# EAGLE design brick_analog_button_smd (EAGLE 7.3.0)
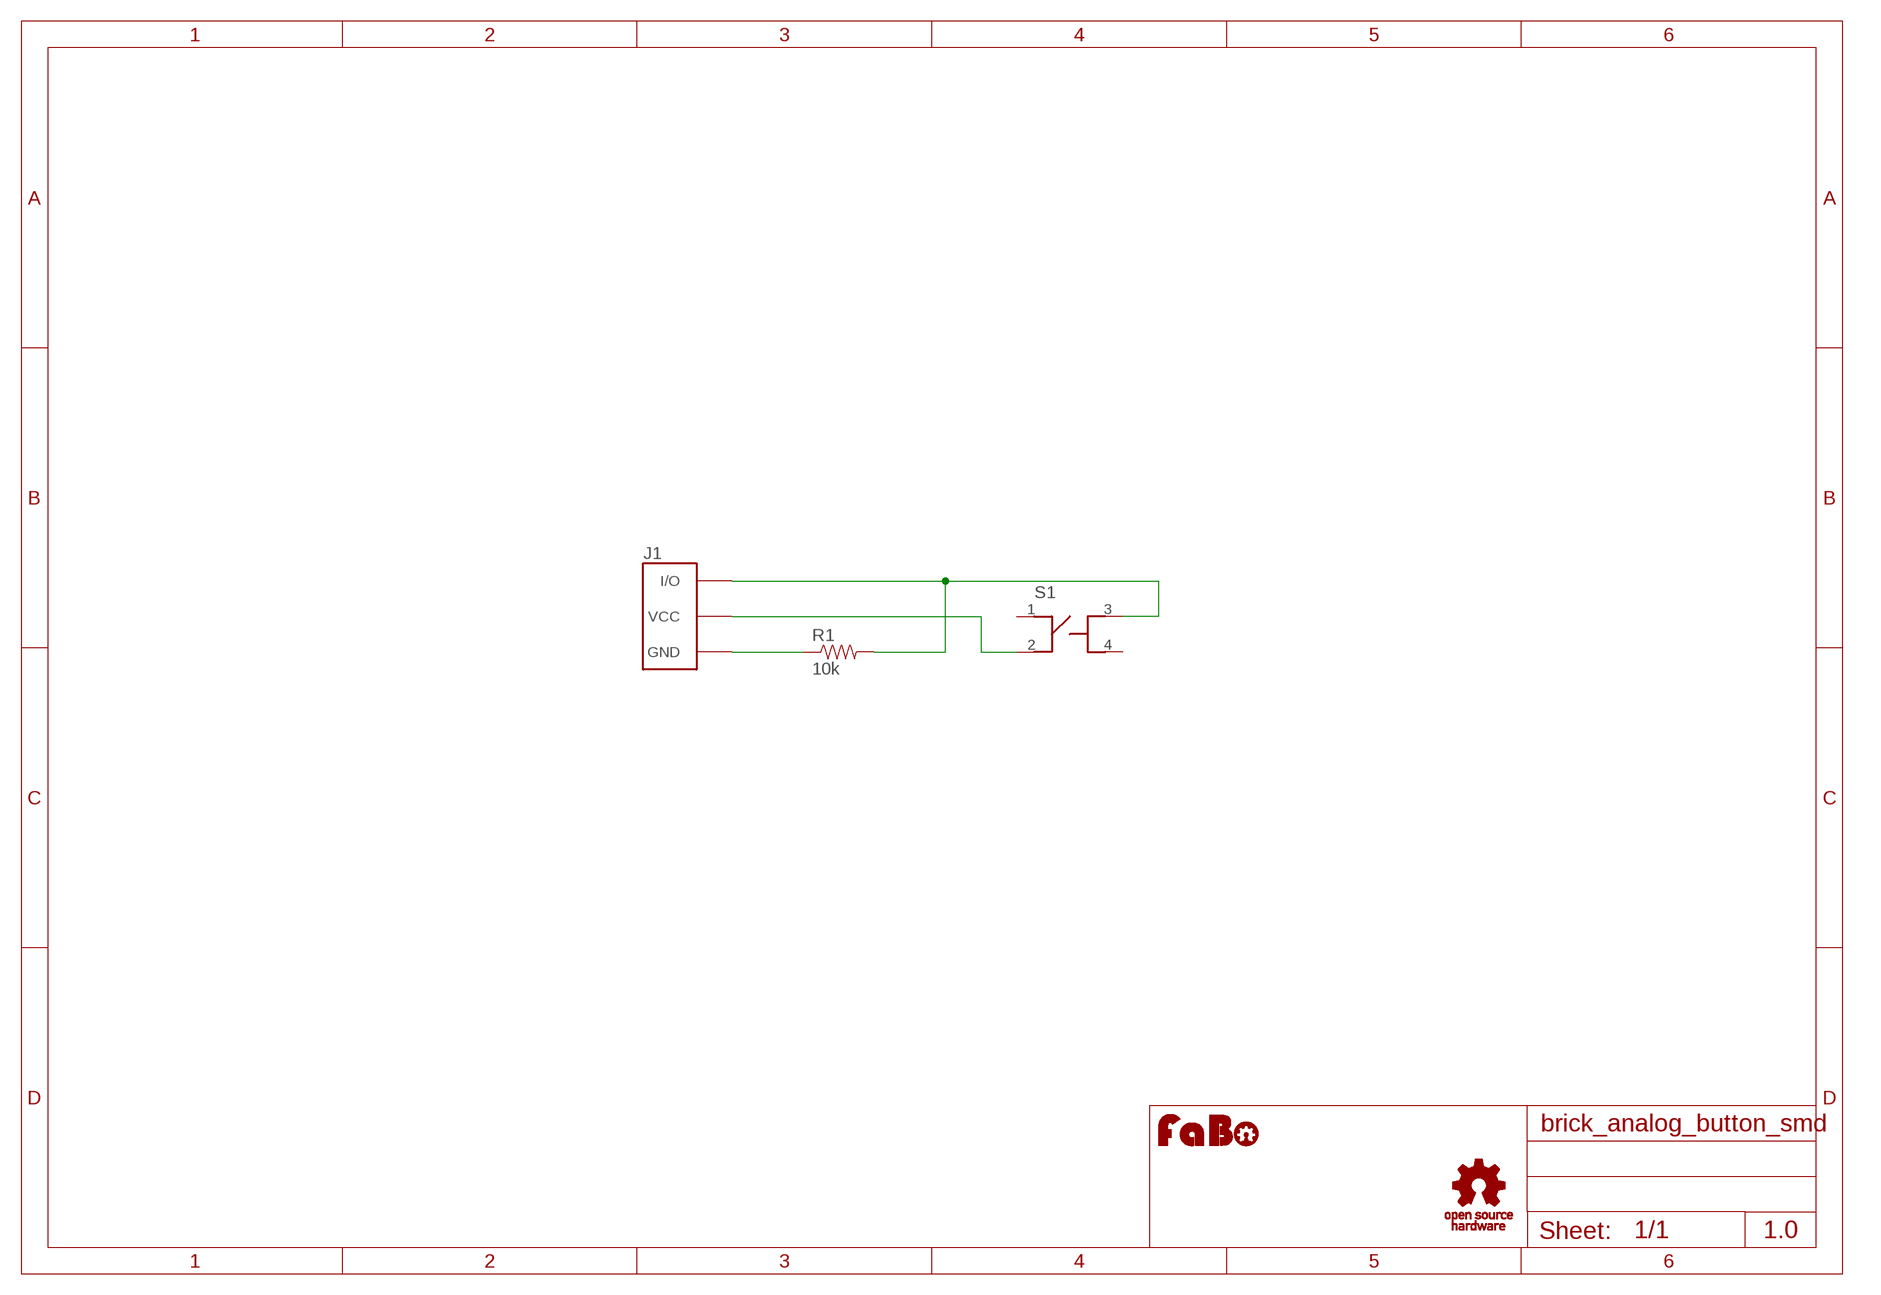
[diagram p0: schematic, sheet 1]

## Parts
J1  BRICK_3PIN_NORMAL  [BRICK_3PIN]
R1  10k  RESISTOR0603  [0603-RES]
S1  SWITCH-LS6J2M-T  [SWITCH-LS6J2M-T]
U$1  LOGO_FABO-M  [LOGO_FABO_M]
U$4  LOGO_OSHW_T-M  [LOGO_OSHW_T_M]

## Nets
GND: J1.GND R1.1
N$1: J1.VCC S1.2
N$3: J1.IN/OUT(I/O) R1.2 S1.3
Unconnected: S1.1 S1.4

## Notes on the sheet
- 1.0

## Library data of the parts
J1 = gclue:BRICK_3PIN: FaBo Brick 3pin
R1 = SparkFun-Resistors:RESISTOR: Resistor Basic schematic elements and footprints for 0603, 1206, and PTH resistors.
S1 = gclue:SWITCH-LS6J2M-T: Switch Tact SMD(LS6J2M-T)
U$1 = FaBo:LOGO_FABO
U$4 = gclue:LOGO_OSHW_T

## Board
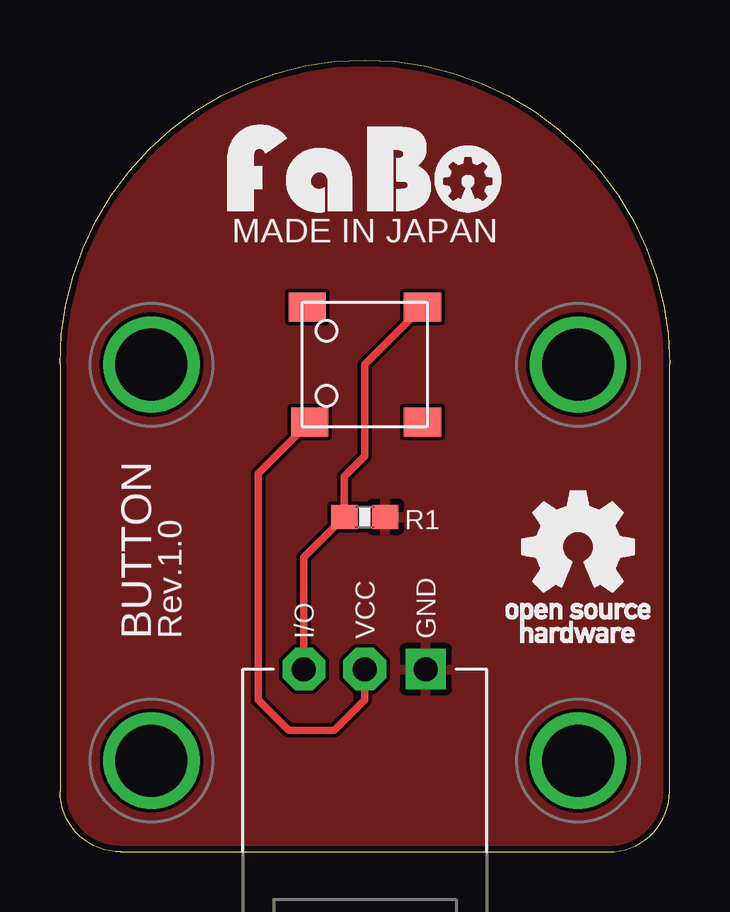
[diagram p1: board, top side]
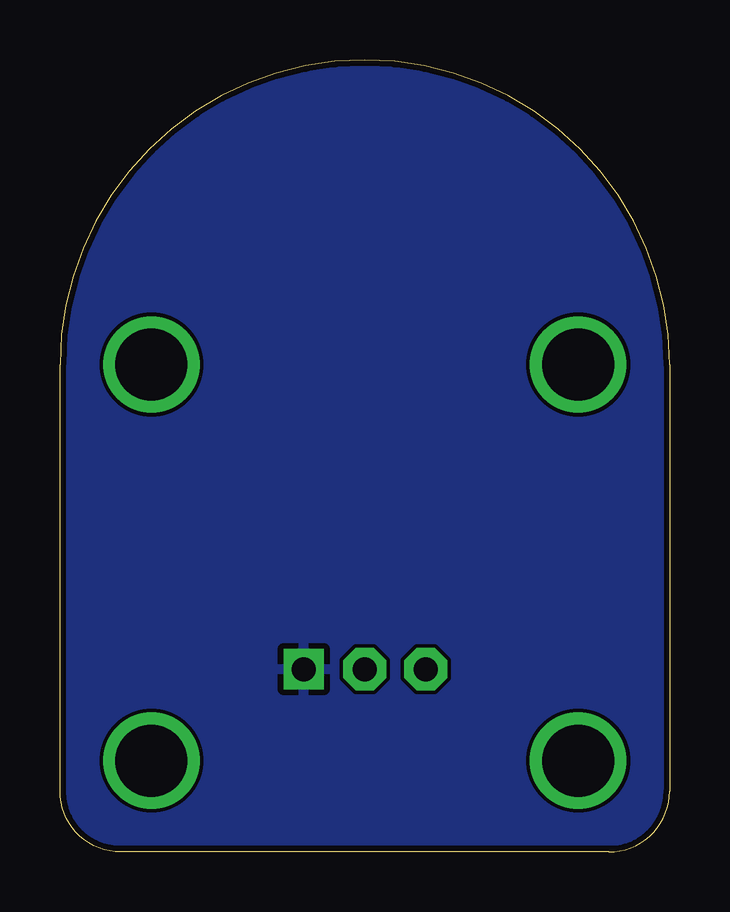
[diagram p2: board, bottom side, seen from below]

Size 25.4 x 33.02 mm. Coordinates in mm from the lower left corner, seen from the top.
Copper layers (1*16): Top 0.035mm / dielectric 1.5mm / Bottom 0.035mm
Design rules "Elecrow_2-layer_eagle_rule": minimum track width 6mil, minimum drill 12mil, track to track 6mil, track to pad 6mil, pad to pad 6mil, via to via 6mil, smd to smd 0mil, copper to edge 10mil, drill to drill 10mil, minimum pad ring 10mil, minimum via ring 6mil, stop-mask expansion 2mil, vias tented up to drill 100mil, thermal gap 10mil

### Footprints (pad centres in the part's own frame; a part is rotated, then mirrored left to right if it is on the bottom)
BRICK_3PIN = drill 1 pad 1.676 square: GND 2.54,-8.89 | drill 1 pad 1.778 octagon: IN/OUT -2.54,-8.89; VCC 0,-8.89 | drill 3 pad 3.81: P$5 -8.89,3.81; P$6 8.89,3.81; P$7 -8.89,-12.7; P$8 8.89,-12.7
0603-RES = smd 1.1 x 1: 1 -0.85,0; 2 0.85,0
SWITCH-LS6J2M-T = smd 1.55 x 1.2: 1 -2.4,2.4; 2 -2.3,-2.4; 3 2.4,2.4; 4 2.4,-2.4

### Placement (x,y rotation side)
J1  12.7,16.51 0 top
R1  12.7,13.97 180 top
S1  12.7,20.32 0 top
U$1  12.7,26.67 0 top
U$4  21.59,12.7 0 top

### Tracks (layer width: path | path; a pad name or v marks a point on that pad's centre or on a via)
GND
  pour Bottom: -1.27,-1.27 26.67,-1.27 26.67,34.29 -1.27,34.29
  pour Top: -1.27,-1.27 26.67,-1.27 26.67,34.29 -1.27,34.29
N$1
  Top 0.305: S1.2 8.26,15.78 8.26,6.35 9.53,5.08 11.43,5.08 12.7,6.35 J1.VCC
N$3
  Top 0.305: J1.IN/OUT 10.16,12.28 R1.2 11.85,15.66 12.7,16.51 12.7,20.32 S1.3

### Text on the board
tPlace: MADE IN JAPAN | BUTTON | Rev.1.0